# Altium schematic sheet 801_GridPos8.SchDoc: Grid Position 8 / USB 7
size A2; Organization: Greenfield Tech Solutions; Address1: Molendreef 33; Address2: Ossendrecht; Address3: 4641CS; Address4: The Netherlands; SheetNumber: 9; SheetTotal: 9
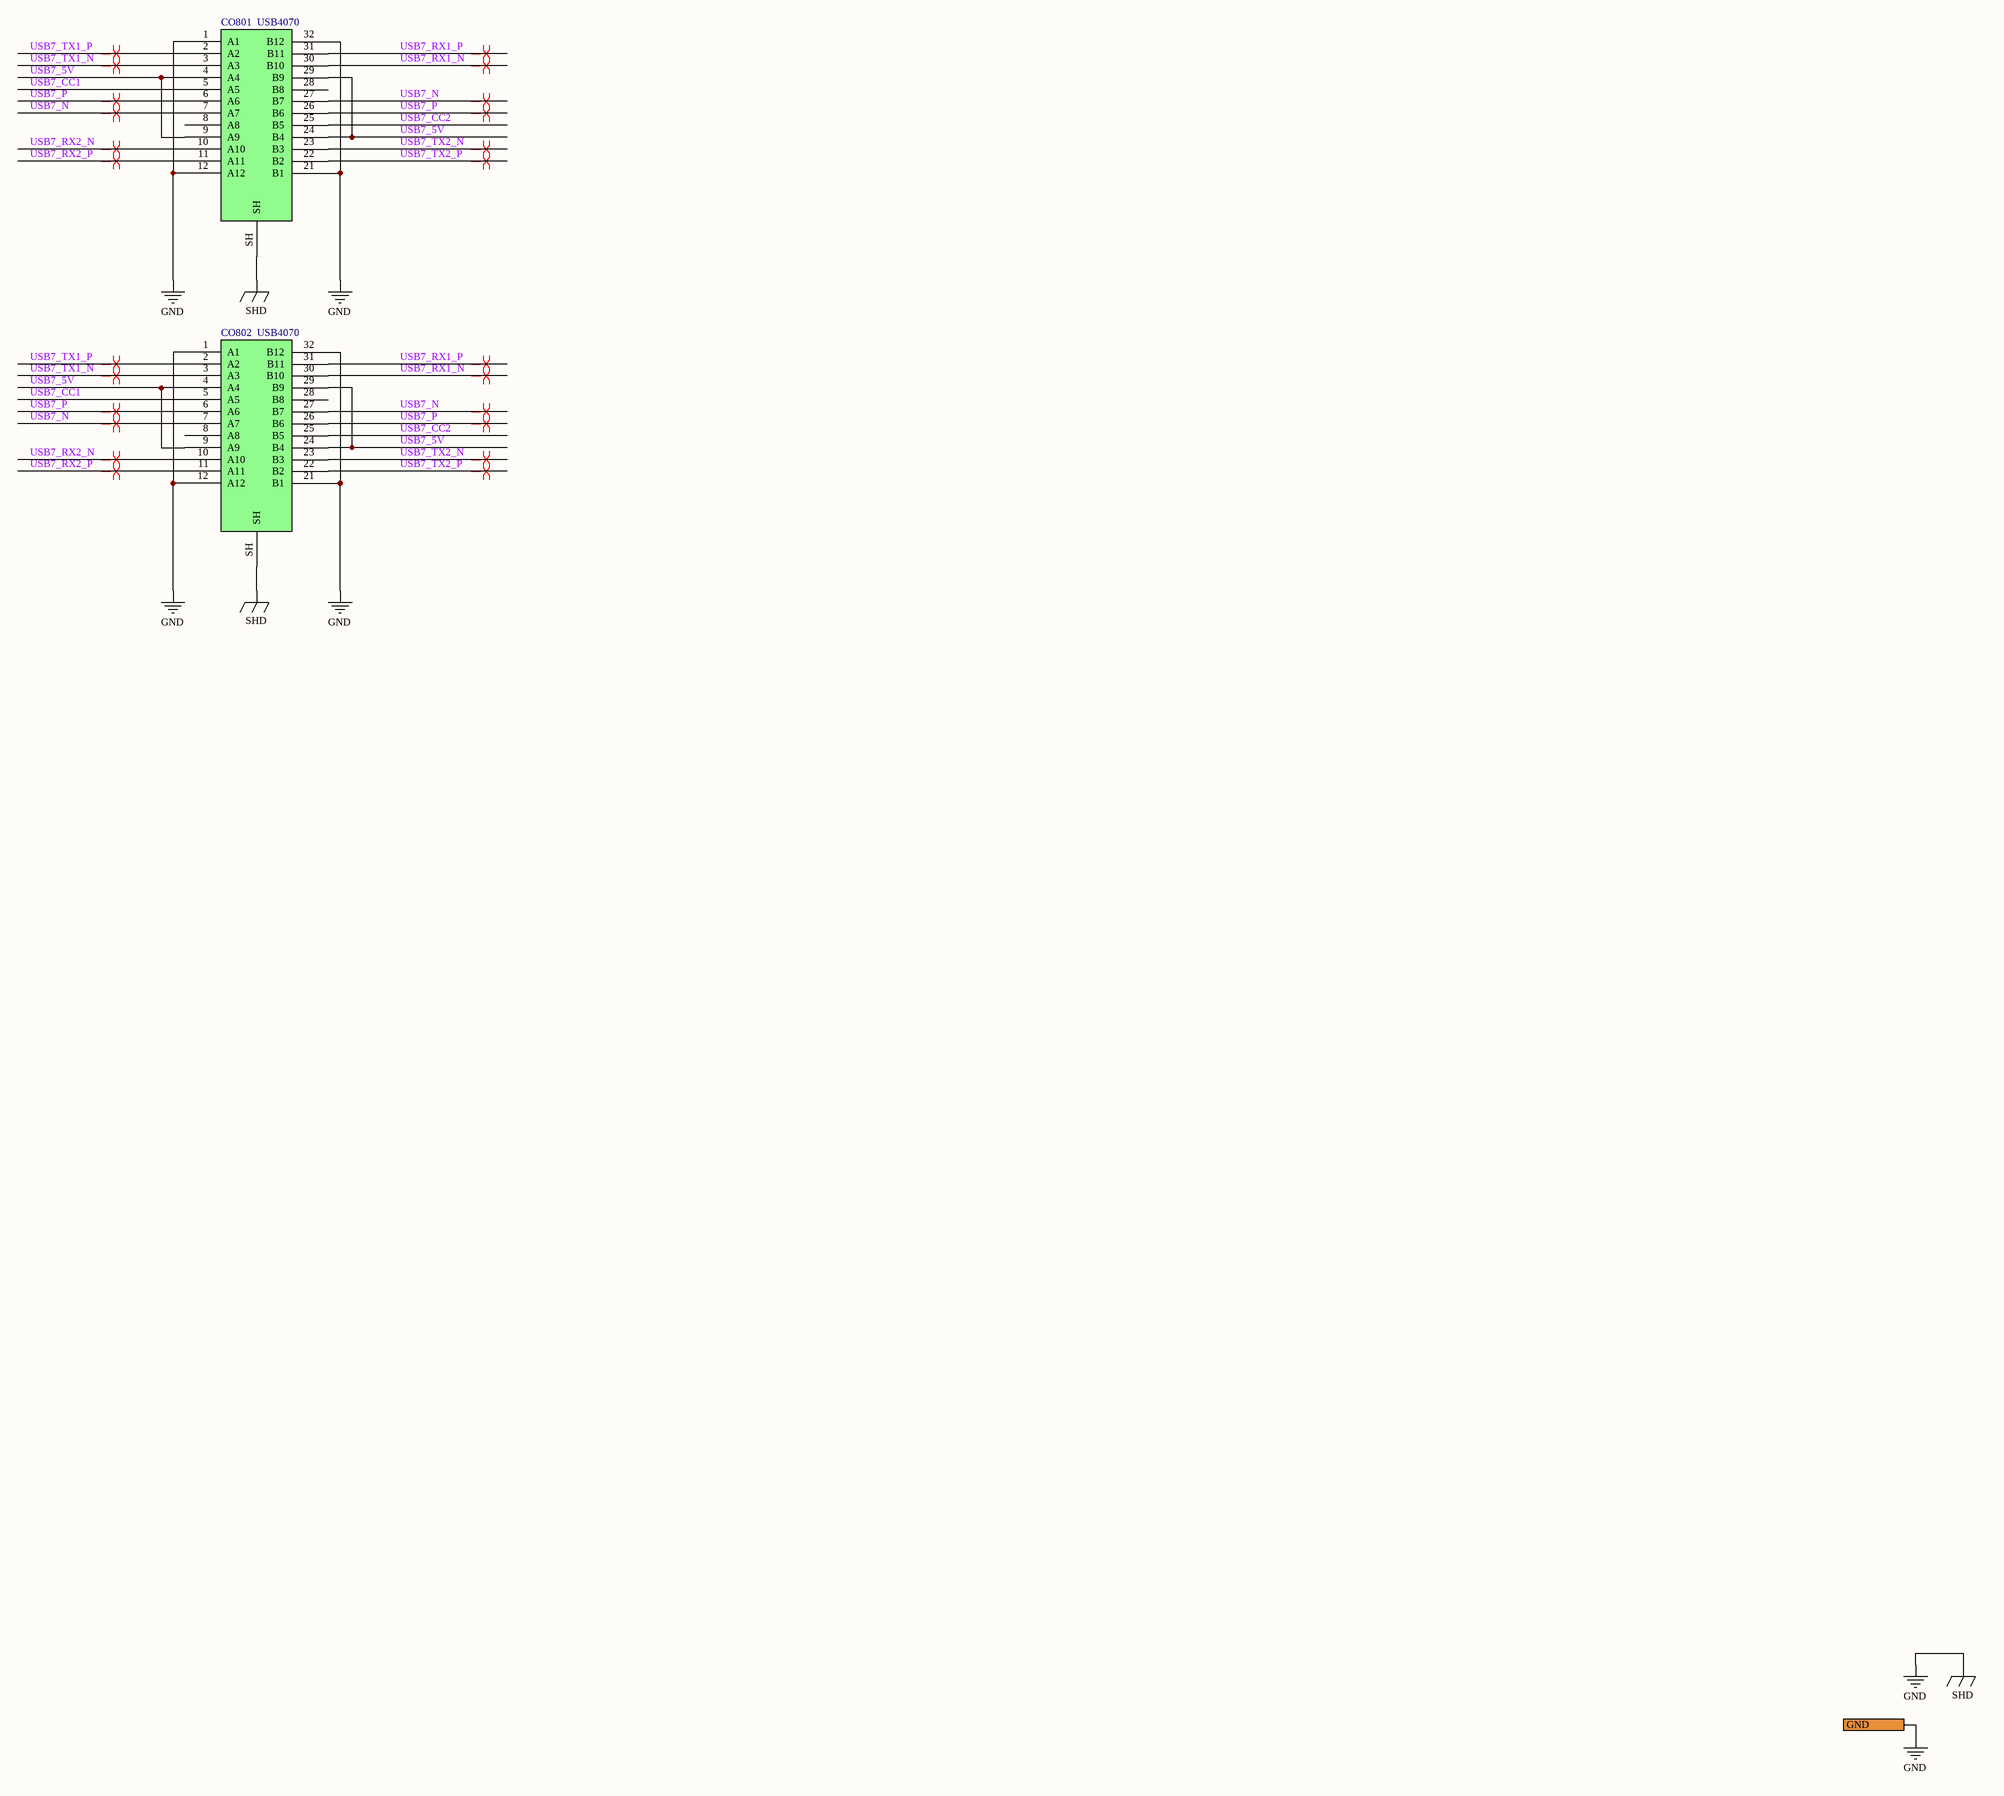
[diagram p0: 801_GridPos8.SchDoc]

## Parts
CO801  USB4070  [USB4070-30-C]
CO802  USB4070  [USB4070-30-C]

## Ports
GND

## Nets
GND: CO801.1(A1) CO801.12(A12) CO801.21(B1) CO801.32(B12) CO801.SH CO802.1(A1) CO802.12(A12) CO802.21(B1) CO802.32(B12) CO802.SH ; port GND  [also labelled SHD]
USB7_5V: CO801.4(A4) CO801.9(A9) CO801.24(B4) CO801.29(B9) CO802.4(A4) CO802.9(A9) CO802.24(B4) CO802.29(B9)
USB7_CC1: CO801.5(A5) CO802.5(A5)
USB7_CC2: CO801.25(B5) CO802.25(B5)
USB7_N: CO801.7(A7) CO801.27(B7) CO802.7(A7) CO802.27(B7)
USB7_P: CO801.6(A6) CO801.26(B6) CO802.6(A6) CO802.26(B6)
USB7_RX1_N: CO801.30(B10) CO802.30(B10)
USB7_RX1_P: CO801.31(B11) CO802.31(B11)
USB7_RX2_N: CO801.10(A10) CO802.10(A10)
USB7_RX2_P: CO801.11(A11) CO802.11(A11)
USB7_TX1_N: CO801.3(A3) CO802.3(A3)
USB7_TX1_P: CO801.2(A2) CO802.2(A2)
USB7_TX2_N: CO801.23(B3) CO802.23(B3)
USB7_TX2_P: CO801.22(B2) CO802.22(B2)

Not connected (* = marked no-connect by the designer): CO801 8(A8) 28(B8); CO802 8(A8) 28(B8)

## Layout directives
differential pair; differential pair class USB3: USB7_N, USB7_P, USB7_RX1_N, USB7_RX1_P, USB7_RX2_N, USB7_RX2_P, USB7_TX1_N, USB7_TX1_P, USB7_TX2_N, USB7_TX2_P

## Notes on the sheet
- Title
- Size:
- Date:
- File:
- A2
- Number:
- Time:
- Revision:
- Sheet
- of

## Library data of the parts
CO801 CO802 = CO0021: USB4070-30-C; Part Number: CO0021; ID: 16; RefVal: USB4070; ManfactPart: USB4070-30-C